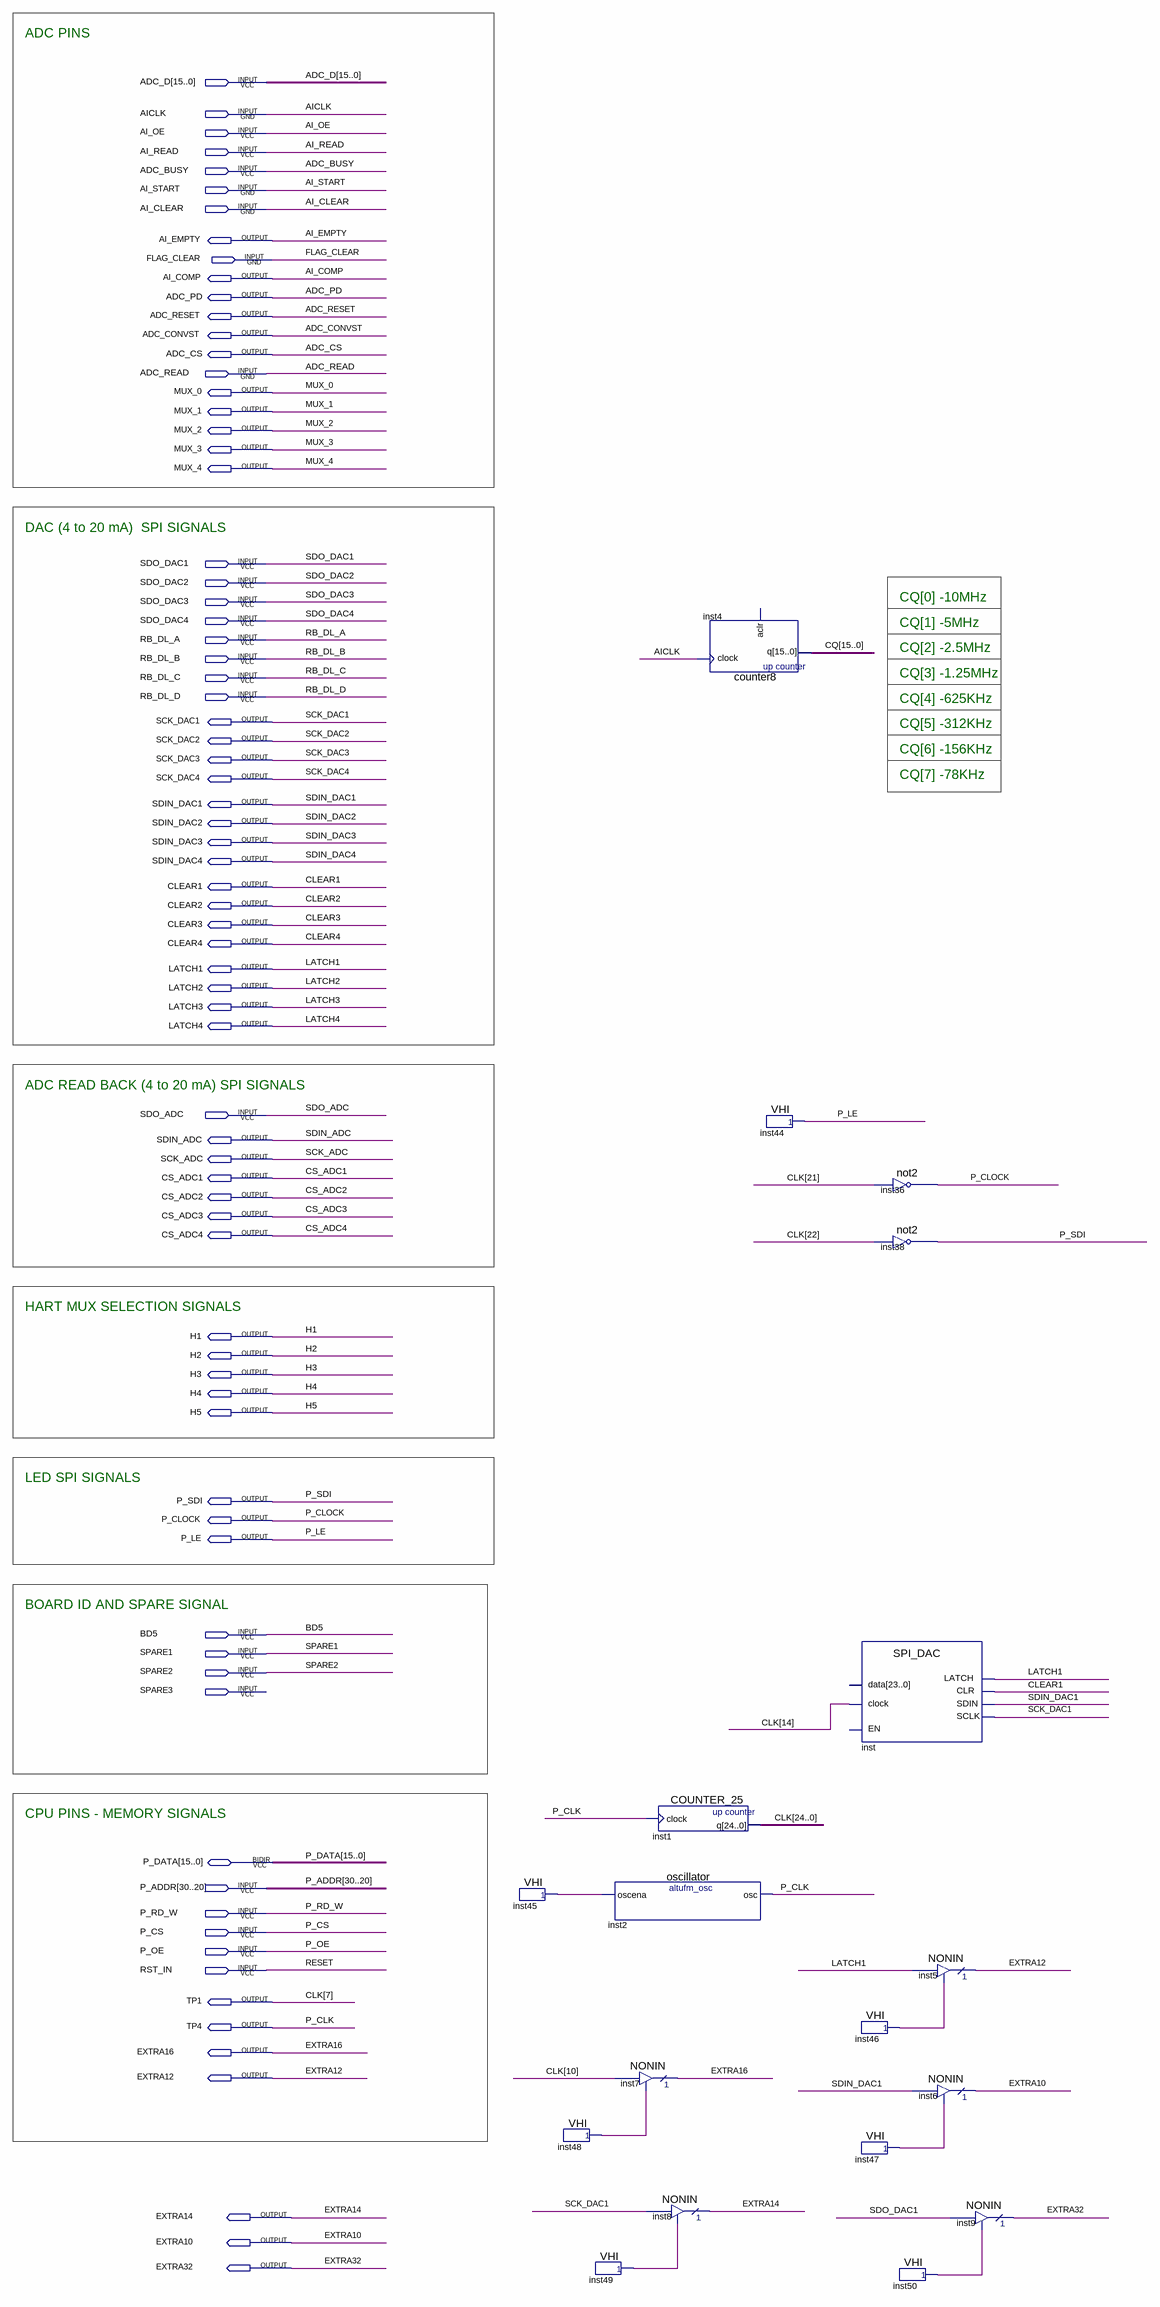
[diagram p0: schematic sheet]
// Quartus schematic IOP.bdf as structural Verilog: 18 symbols, 76 pins
module IOP (
  input  [15:0] ADC_D,
  input  AICLK,
  input  AI_OE,
  input  AI_READ,
  input  ADC_BUSY,
  input  AI_START,
  input  AI_CLEAR,
  input  FLAG_CLEAR,
  input  ADC_READ,
  input  SDO_DAC1,
  input  SDO_DAC2,
  input  SDO_DAC3,
  input  SDO_DAC4,
  input  RB_DL_A,
  input  RB_DL_B,
  input  RB_DL_C,
  input  RB_DL_D,
  input  SDO_ADC,
  input  BD5,
  input  SPARE1,
  input  SPARE2,
  input  SPARE3,
  input  [30:20] P_ADDR,
  input  P_RD_W,
  input  P_CS,
  input  P_OE,
  input  RST_IN,
  inout  [15:0] P_DATA,
  output AI_EMPTY,
  output AI_COMP,
  output ADC_PD,
  output ADC_RESET,
  output ADC_CONVST,
  output ADC_CS,
  output MUX_0,
  output MUX_1,
  output MUX_2,
  output MUX_3,
  output MUX_4,
  output SCK_DAC1,
  output SCK_DAC2,
  output SCK_DAC3,
  output SCK_DAC4,
  output SDIN_DAC1,
  output SDIN_DAC2,
  output SDIN_DAC3,
  output SDIN_DAC4,
  output CLEAR1,
  output CLEAR2,
  output CLEAR3,
  output CLEAR4,
  output LATCH1,
  output LATCH2,
  output LATCH3,
  output LATCH4,
  output SDIN_ADC,
  output SCK_ADC,
  output CS_ADC1,
  output CS_ADC2,
  output CS_ADC3,
  output CS_ADC4,
  output H1,
  output H2,
  output H3,
  output H4,
  output H5,
  output P_SDI,
  output P_CLOCK,
  output P_LE,
  output TP1,
  output TP4,
  output EXTRA16,
  output EXTRA12,
  output EXTRA14,
  output EXTRA10,
  output EXTRA32
);

  wire inst45_result, inst46_result, inst47_result, inst48_result, inst49_result, inst50_result;
  wire [15:0] CQ;
  wire [24:0] CLK;

  VHI inst45 (.result(inst45_result));
  VHI inst48 (.result(inst48_result));
  oscillator inst2 (.oscena(inst45_result), .osc(TP4));
  VHI inst49 (.result(inst49_result));
  COUNTER_25 inst1 (.clock(TP4), .q({CLK[24:8], TP1, CLK[6:0]}));
  NONIN inst7 (.enabledt(inst48_result), .data(CLK[10]), .tridata(EXTRA16));
  NONIN inst8 (.enabledt(inst49_result), .data(SCK_DAC1), .tridata(EXTRA14));
  counter8 inst4 (.clock(AICLK), .q(CQ));  // open: aclr
  VHI inst44 (.result(P_LE));
  SPI_DAC inst (.clock(CLK[14]), .LATCH(LATCH1), .SDIN(SDIN_DAC1), .SCLK(SCK_DAC1), .CLR(CLEAR1));  // open: data, EN
  VHI inst46 (.result(inst46_result));
  VHI inst47 (.result(inst47_result));
  not2 inst36 (.data(CLK[21]), .result(P_CLOCK));
  not2 inst38 (.data(CLK[22]), .result(P_SDI));
  NONIN inst5 (.enabledt(inst46_result), .data(LATCH1), .tridata(EXTRA12));
  NONIN inst6 (.enabledt(inst47_result), .data(SDIN_DAC1), .tridata(EXTRA10));
  VHI inst50 (.result(inst50_result));
  NONIN inst9 (.enabledt(inst50_result), .data(SDO_DAC1), .tridata(EXTRA32));

  // Other names for the same wires on the sheet: CLK[7] = TP1; P_CLK = TP4; RESET = RST_IN

  // Notes on the sheet:
  //   ADC PINS
  //   DAC (4 to 20 mA)  SPI SIGNALS
  //   CQ[0] -
  //   10MHz
  //   CQ[1] -
  //   5MHz
  //   CQ[2] -
  //   2.5MHz
  //   CQ[3] -
  //   1.25MHz
  //   CQ[4] -
  //   625KHz
  //   CQ[5] -
  //   312KHz
  //   CQ[6] -
  //   156KHz
  //   CQ[7] -
  //   78KHz
  //   ADC READ BACK (4 to 20 mA) SPI SIGNALS
  //   HART MUX SELECTION SIGNALS
  //   LED SPI SIGNALS
  //   BOARD ID AND SPARE SIGNAL
  //   CPU PINS - MEMORY SIGNALS
endmodule
